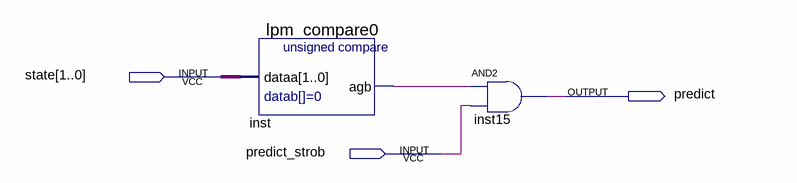
[diagram p0: schematic sheet]
// Quartus schematic PREDICTOR.bdf as structural Verilog: 2 symbols, 3 pins
module PREDICTOR (
  input  [1:0] state,
  input  predict_strob,
  output predict
);

  wire inst_agb;

  lpm_compare0 inst (.dataa(state), .agb(inst_agb));
  and inst15 (predict, inst_agb, predict_strob);
endmodule
